# EAGLE design drv4 (EAGLE 6.5.0)
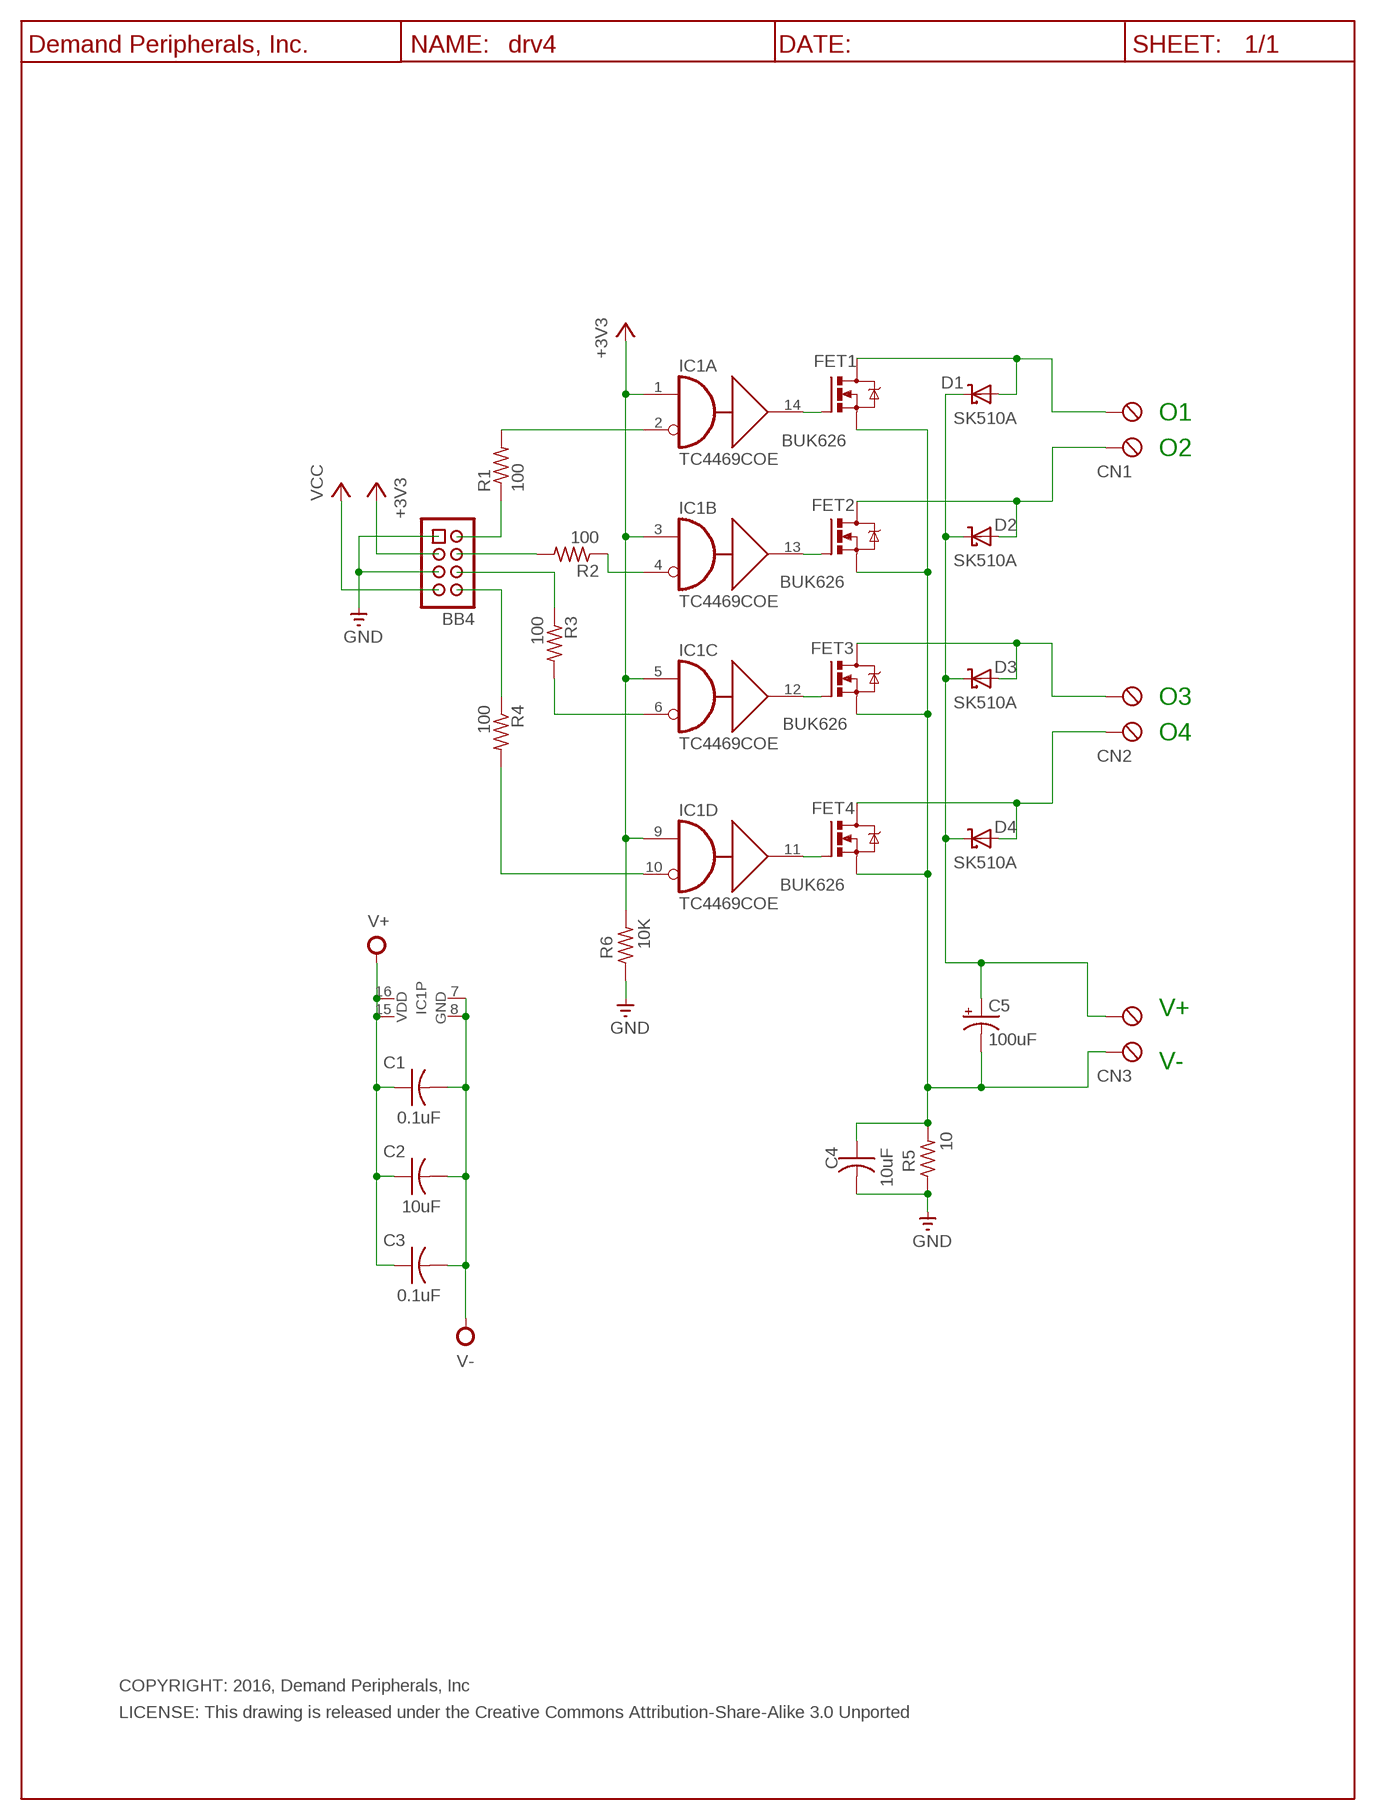
[diagram p0: schematic, sheet 1]

## Parts
BB4  Keyed_Pin_Header_4x2(0.1"x0.1")  HDR-4X2-SHR  [HDR-4X2]
C1  0.1uF  C0.1UF_C0603  [C0603]
C2  10uF  C10UF35V_C0805  [C0805]
C3  0.1uF  C0.1UF_C0603  [C0603]
C4  10uF  C10UF35V_C0805  [C0805]
C5  100uF  C100UF_E3.5-8  [E3.5-8]
CN1  TBLK-5.08-X2  [TBLK-5.08-X2]
CN2  TBLK-5.08-X2  [TBLK-5.08-X2]
CN3  TBLK-5.08-X2  [TBLK-5.08-X2]
D1  SK510A  [SMA]
D2  SK510A  [SMA]
D3  SK510A  [SMA]
D4  SK510A  [SMA]
FET1  BUK626  [DPACK_TO-252]
FET2  BUK626  [DPACK_TO-252]
FET3  BUK626  [DPACK_TO-252]
FET4  BUK626  [DPACK_TO-252]
IC1  TC4469COE  TC4469OESO-16DW  [SO-16DW]
R1  100  R100_R0603  [R0603]
R2  100  R100_R0603  [R0603]
R3  100  R100_R0603  [R0603]
R4  100  R100_R0603  [R0603]
R5  10  R10_R0603  [R0603]
R6  10K  R10K_R0603  [R0603]
U$1  DP_FRAME_P  [P_FRAME]

## Nets
+3V3: BB4.3 IC1.1(A:A) IC1.3(B:A) IC1.5(C:A) IC1.9(D:A) R6.2
GND: BB4.1 BB4.5 C4.2 R5.1 R6.1
N$2: IC1.10(D:B) R4.2
N$3: IC1.2(A:B) R1.2
N$4: IC1.4(B:B) R2.1
N$5: FET1.1(G) IC1.14(A:Y)
N$9: FET2.1(G) IC1.13(B:Y)
N$10: FET3.1(G) IC1.12(C:Y)
N$11: FET4.1(G) IC1.11(D:Y)
N$13: BB4.2 R1.1
N$15: BB4.4 R2.2
N$17: BB4.6 R3.1
N$18: IC1.6(C:B) R3.2
N$19: BB4.8 R4.1
O1: CN2.1(KL) D4.A FET4.4(D)
O2: CN2.2(KL1) D3.A FET3.4(D)
O3: CN1.1(KL) D2.A FET2.4(D)
O4: CN1.2(KL1) D1.A FET1.4(D)
V+: C1.1 C2.1 C3.1 C5.+ CN3.2(KL1) D1.C(CC) D2.C(CC) D3.C(CC) D4.C(CC) IC1.15(P:VDD) IC1.16(P:VDD)
V-: C1.2 C2.2 C3.2 C4.1 C5.- CN3.1(KL) FET1.3(S) FET2.3(S) FET3.3(S) FET4.3(S) IC1.7(P:GND) IC1.8(P:GND) R5.2
VCC: BB4.7

## Notes on the sheet
- O1
- O2
- O3
- O4
- V+
- V-
- COPYRIGHT: 2016, Demand Peripherals, Inc
- LICENSE: This drawing is released under the Creative Commons Attribution-Share-Alike 3.0 Unported

## Library data of the parts
BB4 = dpi-conn:HDR-4X2-SHR: Shrouded 4x2 pin header; VENDOR: Digikey; VENDOR-PART-NUM: 609-3530-ND
C1 C3 = dpi-passive:C0.1UF_: 0.1 uF Capacitor, 25V, X7R; VENDOR: Digikey; VENDOR-PART-NUM: 1276-1126-2-ND
C2 C4 = dpi-passive:C10UF35V_: 10 uF Capacitor, 35V, X6S; VENDOR: Digikey; VENDOR-PART-NUM: 490-10504-1-ND
C5 = dpi-passive:C100UF_: 100uF polarized capacitor, general purpose; VENDOR: Digikey; VENDOR-PART-NUM: 1572-1044-ND
CN1-CN3 = dpi-conn:TBLK-5.08-X2: Terminal Block, 5.08mm, x2, screw terminals; VENDOR: Digikey; VENDOR-PART-NUM: ED2609-ND
D1-D4 = dpi-diopto:SK510A: SK510A Schottky, 5A, 100V; VENDOR: Digikey; VENDOR-PART-NUM: SK510A-LTPMSCT-ND
FET1-FET4 = dpi-transic:BUK626: NXP BUK626 NFET, 60V, 90A, DPACK; VENDOR: Digikey; VENDOR-PART-NUM: 568-9626-2-ND
IC1 = dpi-transic:TC4469OE: Logic-Input CMOS Quad Drivers Source: TC 4469-MOSFET-DRIVER.pdf; VENDOR: Digikey; VENDOR-PART-NUM: TC4469COE713CT-ND
R1-R4 = dpi-passive:R100_: 100 Ohm resistor, 1%, 0.1 watt; VENDOR: Digikey; VENDOR-PART-NUM: 311-100HRTR-ND
R5 = dpi-passive:R10_: 10 Ohm resistor, 1%, 0.1 watt; VENDOR: Digikey; VENDOR-PART-NUM: 311-10.0HRTR-ND
R6 = dpi-passive:R10K_: 10K Resistor, 1%, 0.1 watt; VENDOR: Digikey; VENDOR-PART-NUM: 311-1.00KHRTR-ND
U$1 = dpi-sym:DP_FRAME_P: Portrait/Letter Document Frame

## Board
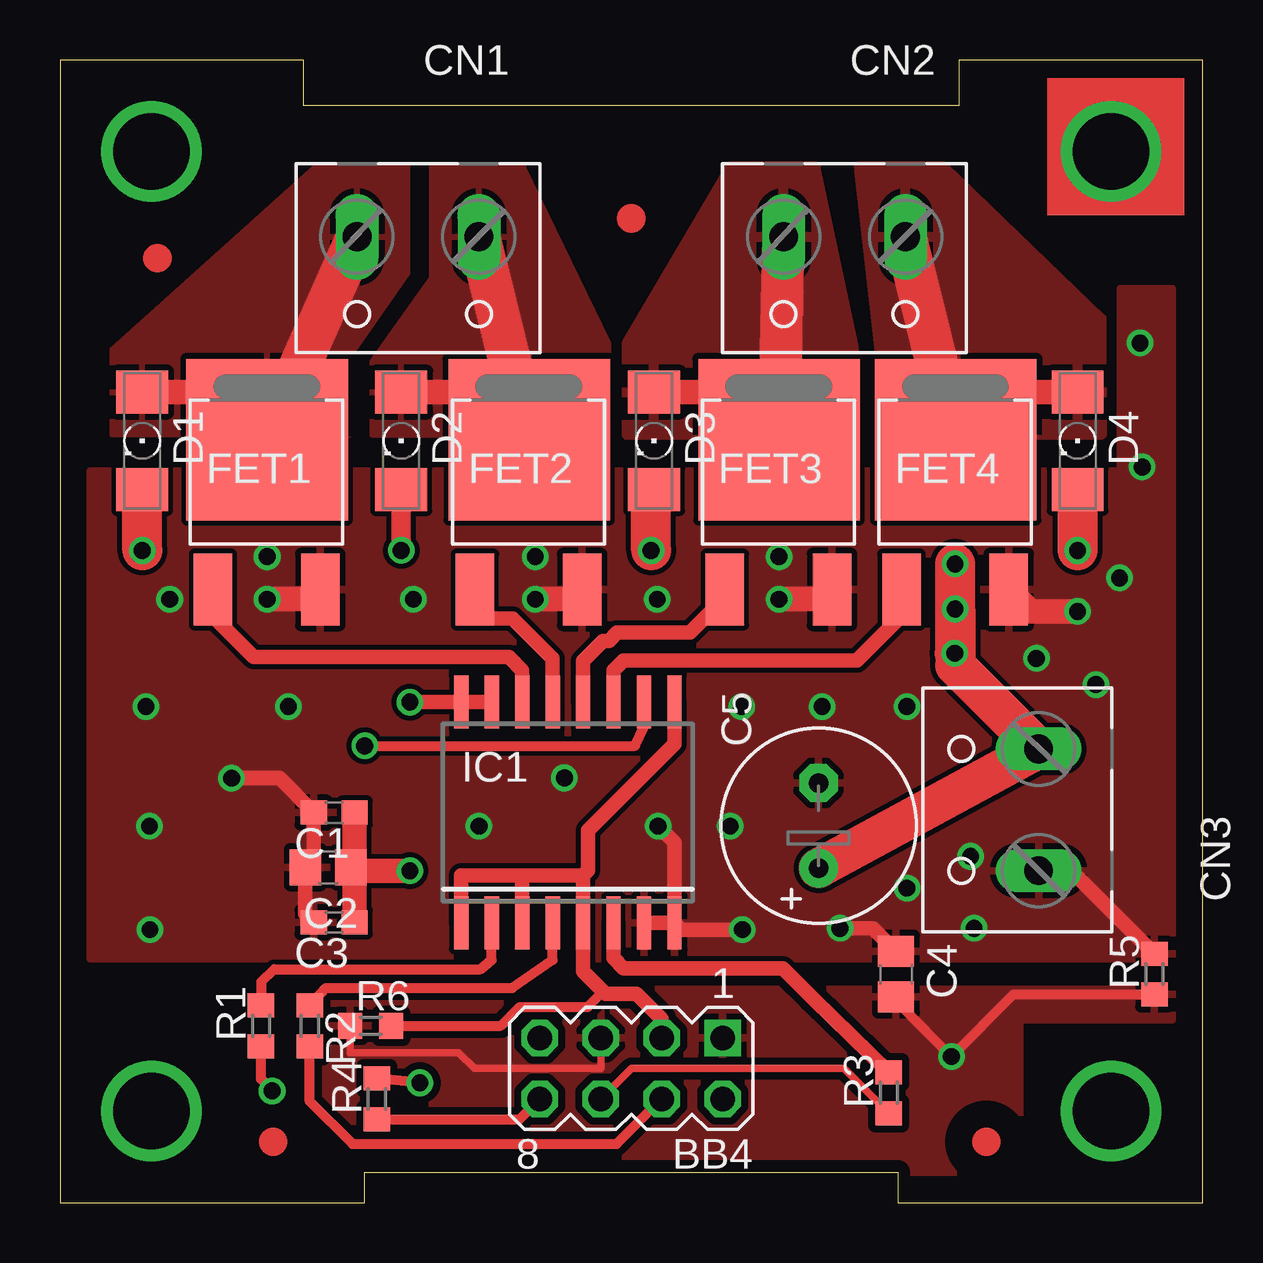
[diagram p1: board, top side]
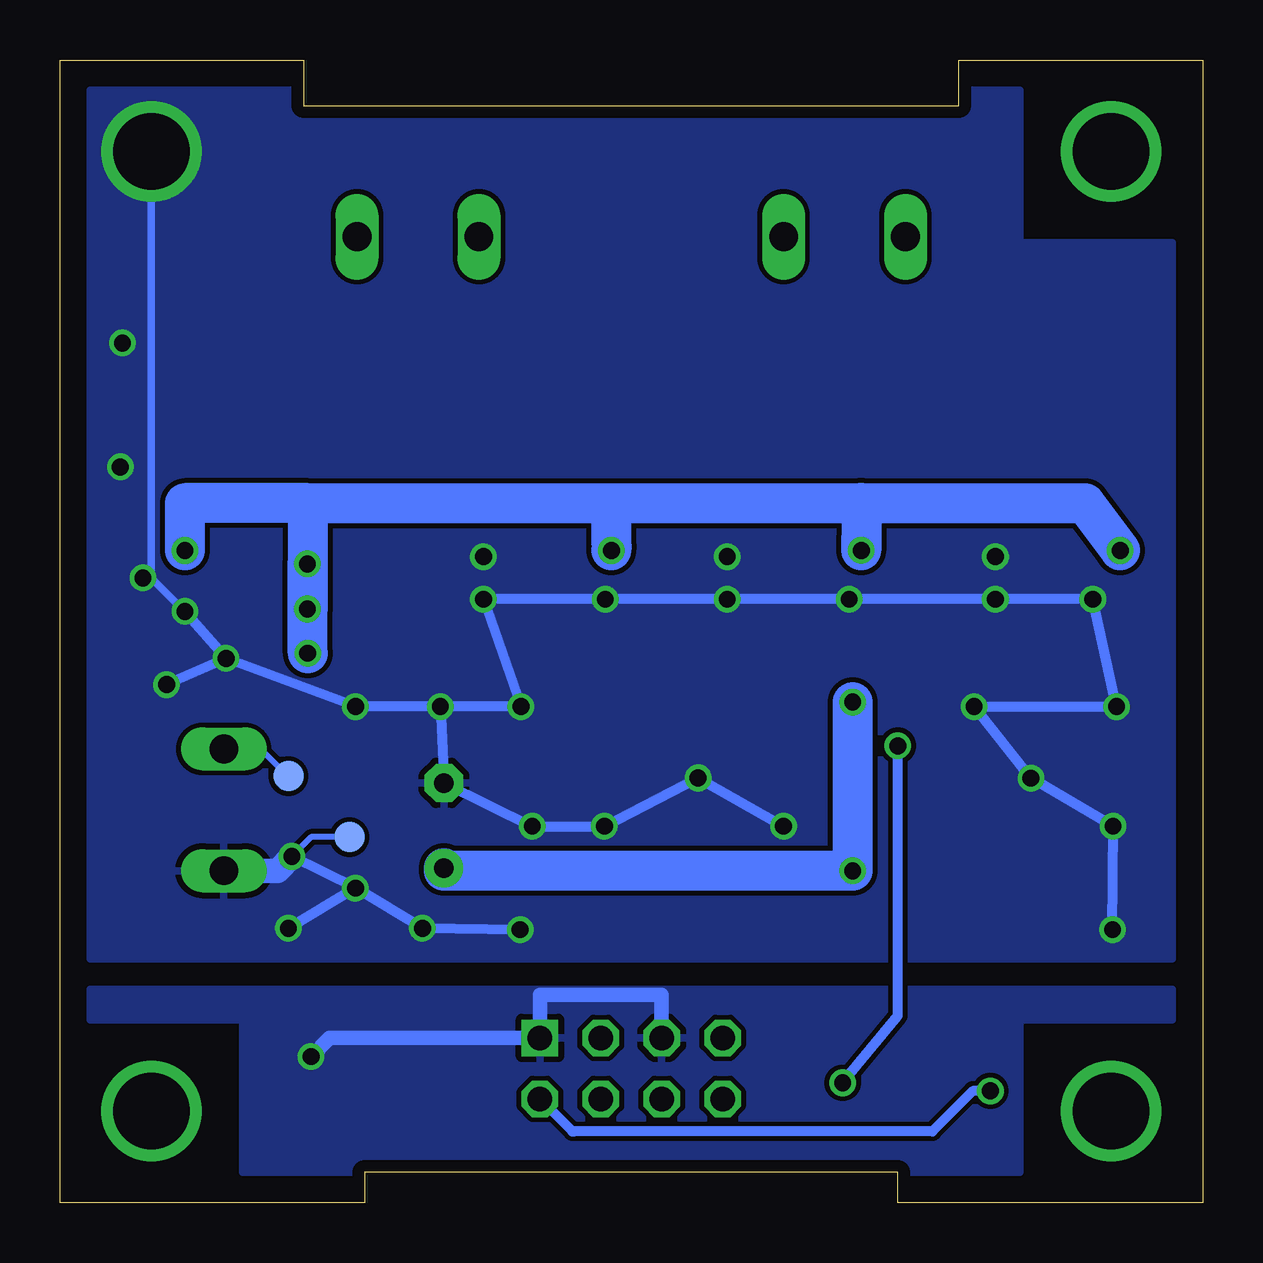
[diagram p2: board, bottom side, seen from below]

Size 47.62 x 47.62 mm. Coordinates in mm from the lower left corner, seen from the top.
Outline: 0,0 12.7,0 12.7,1.27 34.92,1.27 34.92,0 47.62,0 47.62,47.62 37.47,47.62 37.47,45.72 10.16,45.72 10.16,47.62 0,47.62 0,0
Copper layers (1*16): Top 0.035mm / dielectric 1.5mm / Bottom 0.035mm
Design rules "default *": minimum track width 10mil, minimum drill 24mil, track to track 8mil, track to pad 8mil, pad to pad 8mil, via to via 8mil, smd to smd 8mil, copper to edge 20mil, drill to drill 8mil, minimum pad ring 10mil, minimum via ring 8mil, stop-mask expansion 4mil, vias tented up to drill 0mil, thermal gap 10mil
tKeepout: area 15.1,1 to 32.5,9.7

### Footprints (pad centres in the part's own frame; a part is rotated, then mirrored left to right if it is on the bottom)
HDR-4X2 = drill 1.016 square: 1 -3.81,-1.27 | drill 1.016 octagon: 2 -3.81,1.27; 3 -1.27,-1.27; 4 -1.27,1.27; 5 1.27,-1.27; 6 1.27,1.27; 7 3.81,-1.27; 8 3.81,1.27
C0603 = smd 1.1 x 1: 1 -0.85,0; 2 0.85,0
C0805 = smd 1.3 x 1.5: 1 -0.95,0; 2 0.95,0
E3.5-8 = drill 0.813 pad 1.6: + -1.778,0 | drill 0.813 pad 1.6 octagon: - 1.778,0
TBLK-5.08-X2 = drill 1.194 long: 1 -2.54,-0.127; 2 2.54,-0.127
SMA = smd 1.778 x 2.159: A -2.032,0; C 2.032,0
TEST-POINT = smd 1.27 x 1.27: P1 0,0
DPACK_TO-252 = smd 1.6 x 2.997: 1 -2.261,-4.928; 3 2.21,-4.928 | smd 6.731 x 6.731: 4 0,1.321
SO-16DW = smd 0.6 x 2.2: 1 -4.445,-4.6; 2 -3.175,-4.6; 3 -1.905,-4.6; 4 -0.635,-4.6; 5 0.635,-4.6; 6 1.905,-4.6; 7 3.175,-4.6; 8 4.445,-4.6; 9 4.445,4.6; 10 3.175,4.6; 11 1.905,4.6; 12 0.635,4.6; 13 -0.635,4.6; 14 -1.905,4.6; 15 -3.175,4.6; 16 -4.445,4.6
R0603 = smd 1 x 1.1: 1 -0.85,0; 2 0.85,0

### Placement (x,y rotation side)
BB4  23.81,5.59 180 top
C1  11.43,16.26 180 top
C2  11.18,13.97 180 top
C3  11.43,11.68 180 top
C4  34.85,9.53 270 top
C5  31.62,15.71 90 top
CN1  14.92,40.13 180 top
CN2  32.7,40.13 180 top
CN3  40.67,16.37 90 top
D1  3.43,31.75 270 top
D2  14.22,31.75 270 top
D3  24.77,31.75 270 top
D4  42.42,31.75 270 top
E$6  [TEST-POINT]  38.09,17.78 0 bottom
FET1  8.64,30.48 0 top
FET2  19.56,30.48 0 top
FET3  29.97,30.48 0 top
FET4  37.34,30.48 0 top
IC1  21.17,16.26 0 top
R1  8.38,7.37 90 top
R2  10.42,7.37 270 top
R3  34.54,4.57 90 top
R4  13.21,4.32 90 top
R5  45.62,9.53 90 top
R6  12.95,7.37 0 top
U$1  -2.54,-2.54 0 top
U$2  [FIDUCIAL]  8.89,2.54 0 top
U$3  [FIDUCIAL]  38.61,2.54 0 top
U$4  [FIDUCIAL]  23.81,41.02 0 top
U$5  [FIDUCIAL]  4.06,39.37 0 top
U$7  [DPI-2]  6.35,13.97 90 bottom
V-  [TEST-POINT]  35.56,15.24 0 bottom

### Tracks (layer width: path | path; a pad name or v marks a point on that pad's centre or on a via)
+3V3
  Top 0.406: R6.2 18.38,7.37 19.16,8.15 22,8.15 22.64,8.79
  Top 0.61: IC1.1 16.72,13.64 19.26,13.64 | 21.8,13.64 19.26,13.64 | 21.8,13.64 IC1.5 21.8,9.63 22.64,8.79 22.73,8.7 24.04,8.7 25.08,7.66 BB4.3 | 19.26,13.64 IC1.3 | IC1.9 25.61,19.12 22.01,15.52 22.01,13.85 21.8,13.64
GND  (via drill 0.7)
  Top 0.305: R6.1 12.1,6.24 16.62,6.24 17.27,5.59 20.94,5.59 22.54,5.59 BB4.5
  Top 0.406: C4.2 35.12,8.12 v37.16,6.08 39.75,8.67 R5.1
  Bottom 0.61: v37.16,6.08 36.38,6.86 BB4.1 27.62,8.66 23.41,8.66 22.54,8.66 BB4.5
  pour Bottom: 1.27,8.89 1.27,7.62 7.62,7.62 7.62,1.27 40.01,1.27 40.01,7.62 46.35,7.62 46.35,8.89
  pour Top (isolate 0.305): 1.27,8.89 1.27,7.62 7.62,7.62 7.62,1.27 40.01,1.27 40.01,7.62 46.35,7.62 46.35,8.89
N$1
  Bottom 0.254: 35.58,15.23 37.16,15.23 37.99,14.41
N$2  (via drill 0.7)
  Top 0.406: v15,4.99 R4.2 | v12.7,19.04 23.98,19.04 24.34,19.82 IC1.10
  Bottom 0.406: v15,4.99 12.7,7.79 v12.7,19.04
N$3
  Top 0.406: R1.2 8.4,9.21 8.93,9.72 17.53,9.73 17.99,10.11 IC1.2
N$4
  Top 0.406: IC1.4 20.53,10.11 18.84,8.94 11.07,8.94 R2.1
N$5
  Top 0.61: IC1.14 19.26,22.18 18.71,22.73 8.08,22.73 6.25,24.56 6.25,25.42 FET1.1
N$6  (via drill 3.17 pad 3.17)
  other vias: 3.81,3.81
N$7  (via drill 3.17 pad 3.17)
  other vias: 3.81,43.81
N$8  (via drill 3.17 pad 3.17)
  other vias: 43.81,3.81
N$9
  Top 0.61: IC1.13 20.53,22.68 18.87,24.35 17.49,24.35 17.39,24.45 17.39,25.54 17.37,25.55 FET2.1
N$10
  Top 0.61: IC1.12 21.8,22.58 22.63,23.41 22.88,23.41 23.23,23.76 26.26,23.76 27.61,25.11 27.61,25.45 FET3.1
N$11
  Top 0.61: IC1.11 23.07,22.17 23.5,22.6 33.23,22.6 34.89,24.26 34.89,25.37 FET4.1
N$13  (via drill 0.7)
  Top 0.406: v8.84,4.65 8.38,5.14 R1.1
  Bottom 0.406: v8.84,4.65 9.57,4.65 11.26,2.96 26.19,2.96 26.26,2.96 BB4.2
N$15
  Top 0.406: R2.2 10.42,4.21 12.19,2.44 15.42,2.44 23.2,2.44 BB4.4
N$17
  Top 0.305: BB4.6 23.81,5.59 24.64,5.59 32.68,5.59 R3.1
  Top 0.406: 34.34,3.93 R3.1
N$18
  Top 0.61: IC1.6 23.07,10.19 23.5,9.77 25.29,9.77 30.14,9.77 31.43,8.47 | 31.35,8.55 31.43,8.47 | 31.43,8.47 R3.2
N$19
  Top 0.406: R4.1 19.15,3.47 BB4.8
O1
  Top 1.016: D4.A 37.34,33.78 FET4.4
  Top 1.778: CN2.1 FET4.4
  pour Top (isolate 0.254): 43.45,32.02 43.43,36.83 36.84,43.18 33.27,43.18 34.18,35.31 34.18,32.02
O2
  Top 1.016: D3.A 29.97,33.78 FET3.4
  Top 1.778: CN2.2 FET3.4
  pour Top (isolate 0.254): 31.5,43.18 27.94,43.18 23.62,35.81 23.62,32 33.13,32 33.12,35.56
O3
  Top 1.016: D2.A 19.56,33.78 FET2.4
  Top 1.778: CN1.1 FET2.4
  pour Top: 15.49,43.18 15.49,38.53 13.02,35.05 13.02,32 22.86,32 22.86,35.81 19.31,43.18
O4
  Top 1.016: D1.A 8.64,33.78 FET1.4
  Top 1.778: CN1.2 FET1.4
  pour Top: 14.48,43.18 14.48,38.73 12.06,35.31 12.06,32 2.19,32 2.19,35.55 10.67,43.18
S$1
  Bottom 0.254: 38.11,17.77 39.23,18.89 40.83,18.89
V+  (via drill 0.7, 0.7 pad 0.25)
  Top 0.254: D1.C | D1.C 3.43,29.55 | 24.64,29.55 24.77,29.55 D3.C | D4.C 42.42,29.55
  Top 0.61: v14.58,20.86 IC1.16 IC1.15
  Top 0.813: D2.C | D2.C v14.22,27.18
  Top 1.016: 12.28,13.81 C3.1 12.28,13.81 | 12.28,13.81 C1.1 | v14.58,13.83 12.27,13.83 C2.1 12.28,13.81
  Top 1.676: v42.42,27.18 42.42,29.55 | v3.43,27.18 3.43,29.55 | v24.64,27.18 24.64,29.55 | 37.31,22.91 37.31,22.9 37.31,22.39 CN3.2 C5.+ | 37.31,22.91 v37.31,24.74 | v37.31,24.74 v37.31,26.62 | 37.31,22.91 v37.3,22.9 | v37.31,24.74 37.31,22.91
  Bottom 1.676: 14.23,27.69 v14.22,27.18 14.22,29.16 | 24.65,29.15 14.22,29.16 | v3.43,27.18 4.9,29.15 14.22,29.16 | 37.29,29.15 24.65,29.15 | 37.29,29.15 37.35,29.15 42.42,29.15 v42.42,27.18 | v24.64,27.18 24.65,27.68 24.65,29.15 | v14.58,20.86 v14.58,13.83 31.62,13.83 C5.+ | v37.31,26.62 37.3,26.61 v37.3,22.9 | v37.31,24.74 37.29,24.77 37.29,29.15
V-  (via drill 0.7, 3.17 pad 3.17)
  Top 0.61: IC1.8 IC1.7 | v7.15,17.69 9.15,17.69 C1.2 10.58,14.32 C2.2 10.23,12.04 C3.2 | v24.93,15.68 25.61,15 IC1.8 | IC1.8 25.9,11.37 v28.45,11.37 | C4.1 33.89,11.43 v32.51,11.43 | R5.2 42.17,13.83 CN3.1 | CN3.1
  Top 1.016: FET1.3 10.44,25.15 v8.64,25.15 | FET2.3 21.36,25.15 v19.81,25.15 | FET3.3 31.77,25.15 v29.97,25.15 | FET4.3 40.46,24.64 v42.42,24.64
  Bottom 0.305: v43.81,43.81 43.81,26.04 v42.42,24.64
  Bottom 0.406: v40.7,22.68 v43.18,21.59 | v40.7,22.68 v42.42,24.64 | v40.7,22.68 v35.3,20.67 v31.77,20.67 | v31.77,20.67 v28.41,20.67 v29.97,25.15 v24.89,25.15 v19.81,25.15 v14.73,25.15 v8.64,25.15 v4.57,25.15 v3.59,20.67 v9.52,20.67 v7.15,17.69 v3.73,15.68 v3.75,11.37 | v17.46,15.68 v21.03,17.7 v24.93,15.68 v27.94,15.68 C5.- v31.77,20.67 | v28.45,11.37 v32.51,11.43 v35.31,13.11 | v35.31,13.11 v38.1,11.43 | v35.31,13.11 v37.96,14.43
  Bottom 1.016: v37.96,14.43 38.56,13.83 CN3.1 | CN3.1
  other vias: 45.02,35.83 45.11,30.66 44.17,26.04 29.97,26.92 19.81,26.92 8.64,26.92
  pour Top: 1.27,10.16 1.27,30.48 44.2,30.48 44.2,38.1 46.35,38.1 46.35,10.16
  pour Bottom: 1.27,10.16 1.27,40.02 7.62,40.02 7.62,46.35 46.35,46.35 46.35,10.16
(copper drawn outside any net)
  shapes: Top area x1

### Text on the board
tTest: 1.875 Inches | 1.575 Inches | O4 | O3 | O2 | O1 | (C) 2017, Demand Peripherals, Inc. | D1 | D3 | D4 | D2 | FET1 | FET2 | FET3 | FET4 | DRV3, Rev 17A | V+ | C1 | IC1 | 1.575 Inches | 1.875 Inches | C2 | + | C-BULK | C3 | C3 | Gnd | BB4 | R5 | C4 | R1 | R6 | R2 | R3 | R4